# Altium schematic sheet Main.SchDoc
size A3; SheetNumber: 1
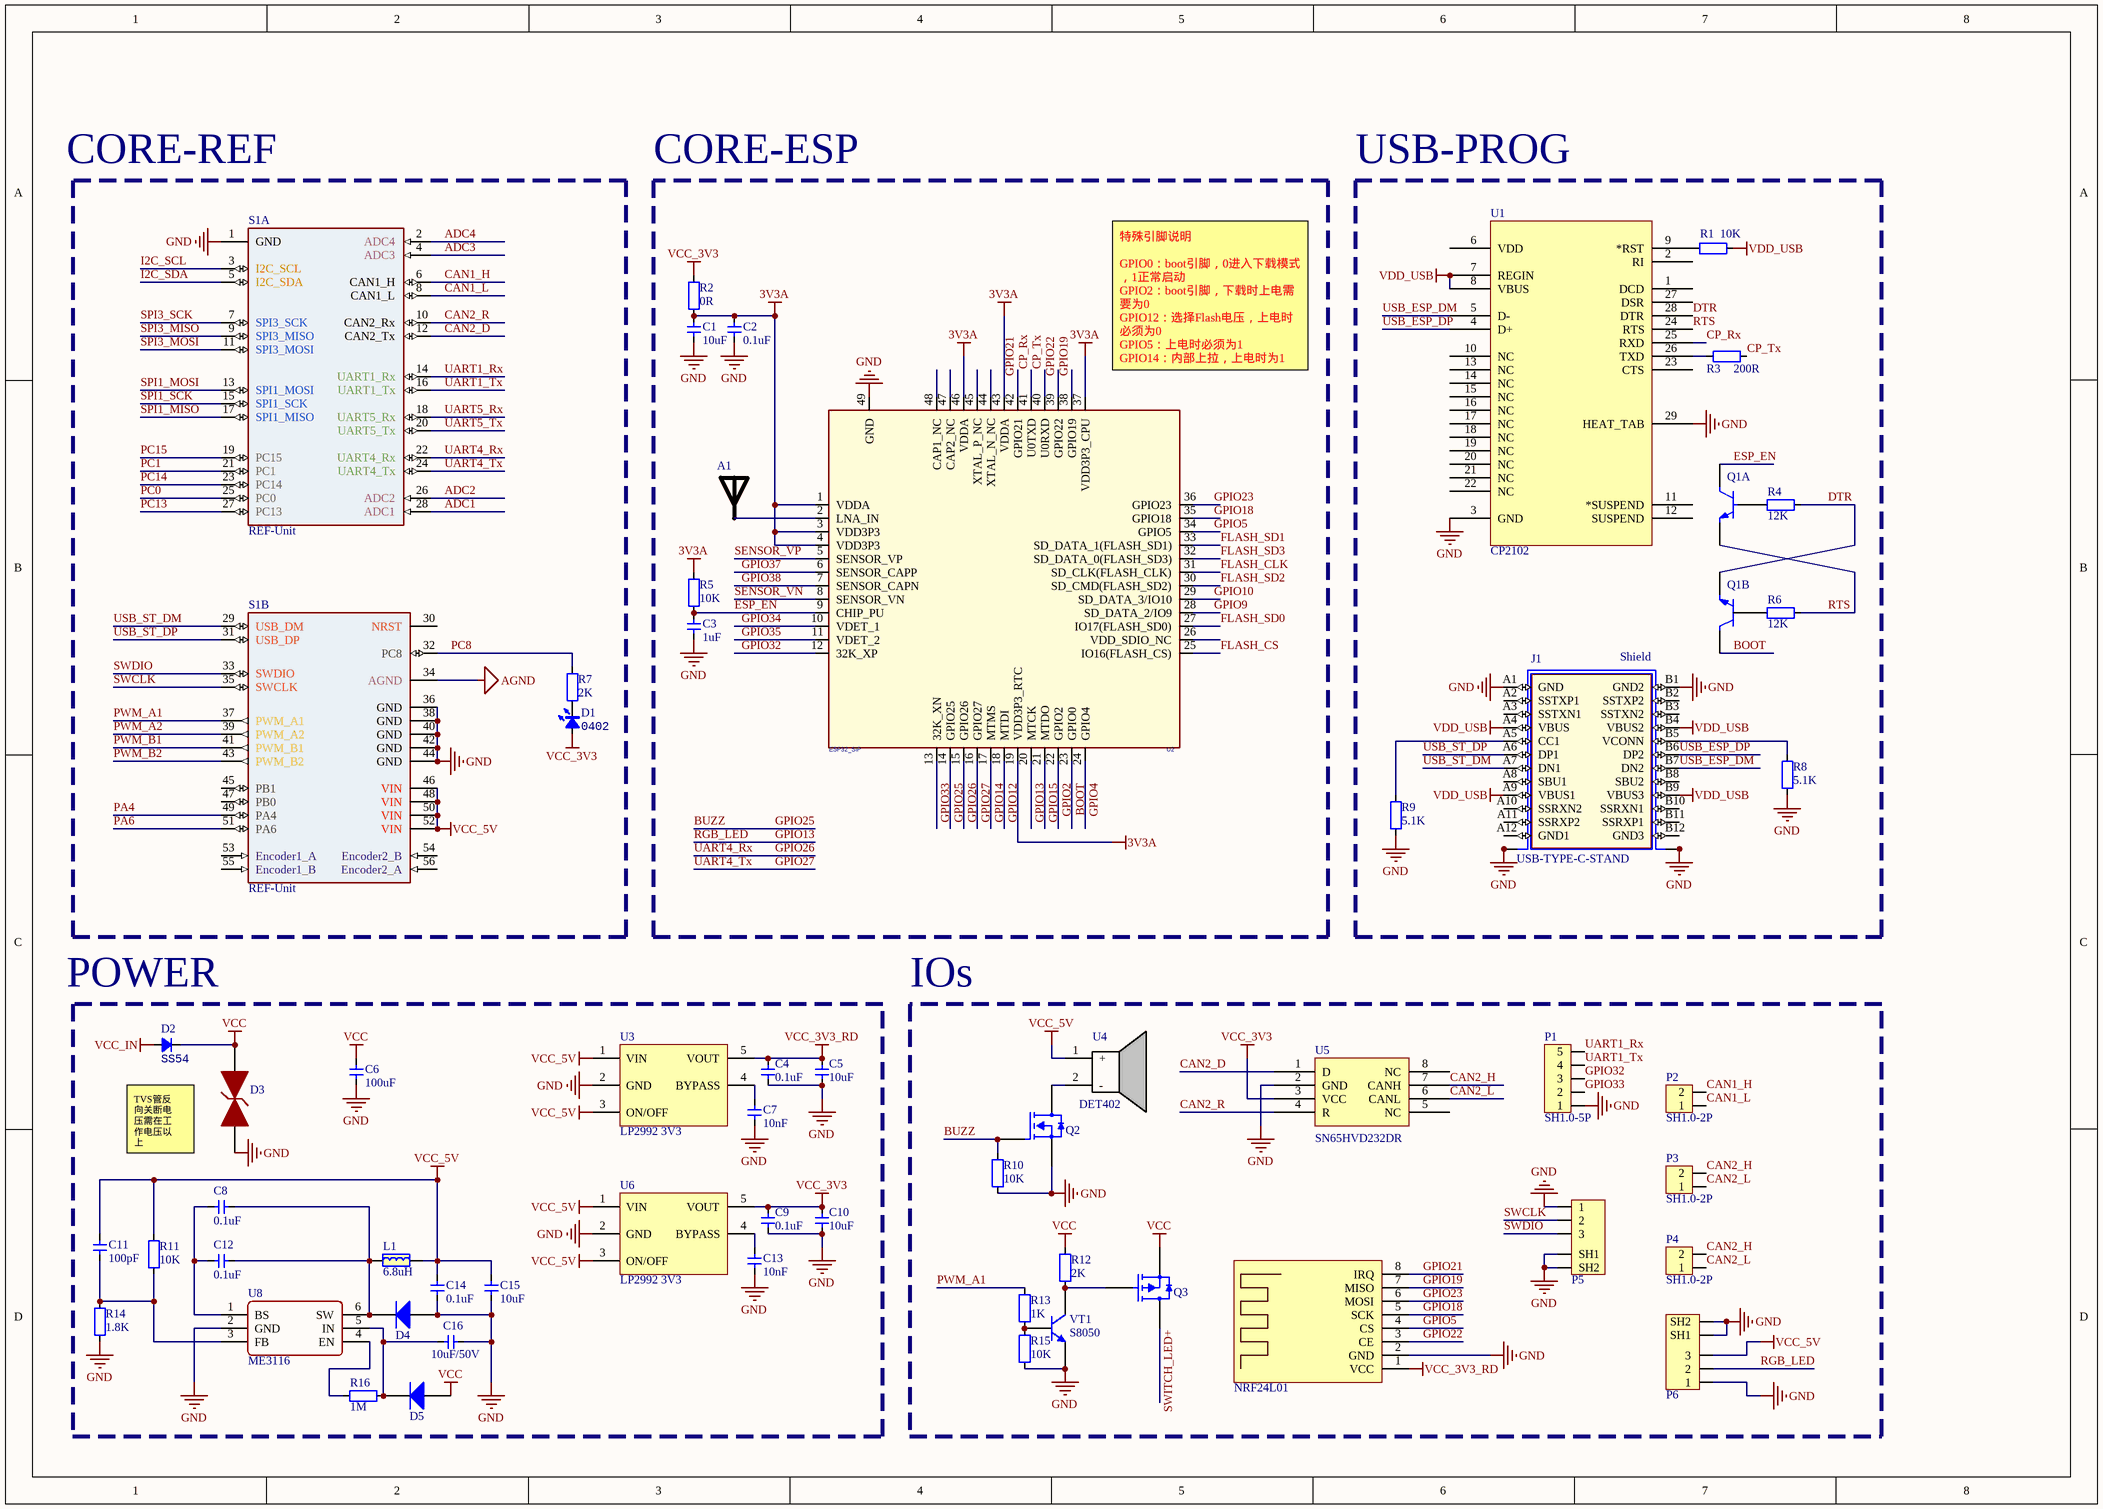
[diagram p0: Main.SchDoc]

## Parts
A1  RAINSUN  [ANT-Rainsun-AN5120]  (value not drawn)
C1  10uF  [CAP_0402]
C2  0.1uF  [CAP_0402]
C3  1uF  [CAP_0402]
C4  0.1uF  [CAP_0402]
C5  10uF  [CAP_0402]
C6  100uF  [1206-CAP]
C7  10nF  [CAP_0402]
C8  0.1uF  [CAP_0402]
C9  0.1uF  [CAP_0402]
C10  10uF  [CAP_0402]
C11  100pF  [CAP_0402]
C12  0.1uF  [CAP_0402]
C13  10nF  [CAP_0402]
C14  0.1uF  [CAP_0402]
C15  10uF  [CAP_0402]
C16  10uF/50V  [CAP_0402]
D1  Type: 0402  [LED_0402_RED]  (hidden comment: color?)
D2  SS54  [DO-214AC]
D3  SMBJ28CA  [SMBJ-CA_MFG]  (value not drawn)
D4  二极管-5819W  [SOD-323]  (value not drawn)
D5  二极管-5819W  [SOD-323]  (value not drawn)
J1  USB-TYPE-C-STAND  [USB-TYPE-C-STAND]
L1  6.8uH  [IND-201612]
P1  SH1.0-5P  [SH1.0-5P]
P2  SH1.0-2P  [SH1.0-2P]
P3  SH1.0-2P  [SH1.0-2P]
P4  SH1.0-2P  [SH1.0-2P]
P5  SH1.0-3P  [SH1.0-3P]  (value not drawn)
P6  SH1.0-3P  [SH1.0-3P]  (value not drawn)
Q1  BC847BVC-7  [SOT563-6]  (value not drawn)  (parts A,B of 2)
Q2  AO3400A  [SOT23-3]  (value not drawn)
Q3  AO3401A  [SOT23-3]  (value not drawn)
R1  10K  [RES_0402]
R2  0R  [RES_0402]
R3  200R  [RES_0402]
R4  12K  [RES_0402]
R5  10K  [RES_0402]
R6  12K  [RES_0402]
R7  2K  [RES_0402]
R8  5.1K  [RES_0402]
R9  5.1K  [RES_0402]
R10  10K  [RES_0402]
R11  10K  [RES_0402]
R12  2K  [RES_0402]
R13  1K  [RES_0402]
R14  1.8K  [RES_0402]
R15  10K  [RES_0402]
R16  1M  [RES_0402]
S1  REF-Unit  [REF-UNIT]  (parts A,B of 2)
U1  CP2102  [QFN-28]
U2  ESP32_SIP  [QFN-48_7X7]
U3  LP2992 3V3  [SOT23-5]
U4  DET402  [DET402]
U5  Manufacturer Part Number: SN65HVD232DR  [SO-8]  (hidden comment: SN65HVD232D)
U6  LP2992 3V3  [SOT23-5]
U7  NRF24L01  [NRF24L01-MODULE]
U8  ME3116  [SOT23-6]
VT1  S8050  [SMT_TRIODE_NPN]

## Blocks framed on the sheet
CORE-ESP: A1 C1-C3 R2 R5 U2
USB-PROG: J1 Q1 R1 R3 R4 R6 R8 R9 U1
IOs: P1-P6 Q2 Q3 R10 R12 R13 R15 U4 U5 U7 VT1

## Nets
3V3A: C1.2 C2.2 R2.2 R5.1 U2.1(VDDA) U2.3(VDD3P3) U2.4(VDD3P3) U2.19(VDD3P3_RTC) U2.37(VDD3P3_CPU) U2.43(VDDA) U2.46(VDDA)
AGND: S1.34(AGND)
GND: C1.1 C2.1 C3.2 C4.1 C5.1 C6.1 C7.1 C9.1 C10.1 C13.1 C14.1 C15.1 C16.1 D3.1 D4.1(A) J1.A1(GND) J1.B1(GND2) J1.S1(SHIELD) J1.S2(SHIELD) J1.S3(SHIELD1) J1.S4(SHIELD1) P1.1 P5.1 P5.SH1 P5.SH2 P6.1 P6.SH1 P6.SH2 Q2.2(S) R8.2 R9.2 R10.1 R14.1 R15.2 S1.1(GND) S1.36(GND) S1.38(GND) S1.40(GND) S1.42(GND) S1.44(GND) U1.3(GND) U1.29(HEAT_TAB) U2.49(GND) U3.2(GND) U5.2(GND) U6.2(GND) U7.2(GND) U8.2(GND) VT1.2(E)
VCC: C6.2 D2.2(K) D3.2 D5.1(A) Q3.2(S) R12.2
VCC_3V3: C9.2 C10.2 D1.1(A) R2.1 U5.3(VCC) U6.5(VOUT)
VCC_3V3_RD: C4.2 C5.2 U3.5(VOUT) U7.1(VCC)
VCC_5V: C11.1 C14.2 C15.2 L1.2 P6.3 R11.2 S1.46(VIN) S1.48(VIN) S1.50(VIN) S1.52(VIN) U3.1(VIN) U3.3(ON/OFF) U4.1(+) U6.1(VIN) U6.3(ON/OFF)
VCC_IN: D2.1(A)
VDD_USB: J1.A4(VBUS) J1.A9(VBUS1) J1.B4(VBUS2) J1.B9(VBUS3) R1.1 U1.7(REGIN) U1.8(VBUS)
ADC1: S1.28(ADC1)
ADC2: S1.26(ADC2)
ADC3: S1.4(ADC3)
ADC4: S1.2(ADC4)
BOOT: Q1.3(C2) U2.23(GPIO0)
BUZZ: Q2.1(G) R10.2 U2.14(GPIO25)  [also labelled GPIO25]
CAN1_H: P2.2 S1.6(CAN1_H)
CAN1_L: P2.1 S1.8(CAN1_L)
CAN2_D: S1.12(CAN2_Tx) U5.1(D)
CAN2_H: P3.2 P4.2 U5.7(CANH)
CAN2_L: P3.1 P4.1 U5.6(CANL)
CAN2_R: S1.10(CAN2_Rx) U5.4(R)
CP_Rx: U1.25(RXD) U2.41(U0TXD)
CP_Tx: R3.1 U2.40(U0RXD)
DTR: Q1.4(E2) R4.1 U1.28(DTR)
ESP_EN: C3.1 Q1.6(C1) R5.2 U2.9(CHIP_PU)
FLASH_CLK: U2.31(SD_CLK(FLASH_CLK))
FLASH_CS: U2.25(IO16(FLASH_CS))
FLASH_SD0: U2.27(IO17(FLASH_SD0))
FLASH_SD1: U2.33(SD_DATA_1(FLASH_SD1))
FLASH_SD2: U2.30(SD_CMD(FLASH_SD2))
FLASH_SD3: U2.32(SD_DATA_0(FLASH_SD3))
GPIO2: U2.22(GPIO2)
GPIO4: U2.24(GPIO4)
GPIO5: U2.34(GPIO5) U7.4(CS)
GPIO9: U2.28(SD_DATA_2/IO9)
GPIO10: U2.29(SD_DATA_3/IO10)
GPIO12: U2.18(MTDI)
GPIO13: P6.2 U2.20(MTCK)  [also labelled RGB_LED]
GPIO14: U2.17(MTMS)
GPIO15: U2.21(MTDO)
GPIO18: U2.35(GPIO18) U7.5(SCK)
GPIO19: U2.38(GPIO19) U7.7(MISO)
GPIO21: U2.42(GPIO21) U7.8(IRQ)
GPIO22: U2.39(GPIO22) U7.3(CE)
GPIO23: U2.36(GPIO23) U7.6(MOSI)
GPIO26: S1.22(UART4_Rx) U2.15(GPIO26)  [also labelled UART4_Rx]
GPIO27: S1.24(UART4_Tx) U2.16(GPIO27)  [also labelled UART4_Tx]
GPIO32: P1.3 U2.12(32K_XP)
GPIO33: P1.2 U2.13(32K_XN)
GPIO34: U2.10(VDET_1)
GPIO35: U2.11(VDET_2)
GPIO37: U2.6(SENSOR_CAPP)
GPIO38: U2.7(SENSOR_CAPN)
I2C_SCL: S1.3(I2C_SCL)
I2C_SDA: S1.5(I2C_SDA)
PA4: S1.49(PA4)
PA6: S1.51(PA6)
PC0: S1.25(PC0)
PC1: S1.21(PC1)
PC8: R7.1 S1.32(PC8)
PC13: S1.27(PC13)
PC14: S1.23(PC14)
PC15: S1.19(PC15)
PWM_A1: R13.1 S1.37(PWM_A1)
PWM_A2: S1.39(PWM_A2)
PWM_B1: S1.41(PWM_B1)
PWM_B2: S1.43(PWM_B2)
RTS: Q1.1(E1) R6.1 U1.24(RTS)
SENSOR_VN: U2.8(SENSOR_VN)
SENSOR_VP: U2.5(SENSOR_VP)
SPI1_MISO: S1.17(SPI1_MISO)
SPI1_MOSI: S1.13(SPI1_MOSI)
SPI1_SCK: S1.15(SPI1_SCK)
SPI3_MISO: S1.9(SPI3_MISO)
SPI3_MOSI: S1.11(SPI3_MOSI)
SPI3_SCK: S1.7(SPI3_SCK)
SWCLK: P5.2 S1.35(SWCLK)
SWDIO: P5.3 S1.33(SWDIO)
SWITCH_LED+: Q3.3(D)
UART1_Rx: P1.5 S1.14(UART1_Rx)
UART1_Tx: P1.4 S1.16(UART1_Tx)
UART5_Rx: S1.18(UART5_Rx)
UART5_Tx: S1.20(UART5_Tx)
USB_ESP_DM: J1.B7(DN2) U1.5(D-)
USB_ESP_DP: J1.B6(DP2) U1.4(D+)
USB_ST_DM: J1.A7(DN1) S1.29(USB_DM)
USB_ST_DP: J1.A6(DP1) S1.31(USB_DP)
NetA1_1: A1.1 U2.2(LNA_IN)
NetC7_2: C7.2 U3.4(BYPASS)
NetC8_1: C8.1 C12.1 D4.2(K) L1.1 U8.6(SW)
NetC8_2: C8.2 C12.2 U8.1(BS)
NetC11_2: C11.2 R11.1 R14.2 U8.3(FB)
NetC13_2: C13.2 U6.4(BYPASS)
NetC16_2: C16.2 D5.2(K) R16.1 U8.5(IN)
NetD1_2: D1.2(K) R7.2
NetJ1_A5: J1.A5(CC1) R9.1
NetJ1_B5: J1.B5(VCONN) R8.1
NetQ1_2: Q1.2(B1) R4.2
NetQ1_5: Q1.5(B2) R6.2
NetQ2_3: Q2.3(D) U4.2(-)
NetQ3_1: Q3.1(G) R12.1 VT1.3(C)
NetR1_2: R1.2 U1.9(*RST)
NetR3_2: R3.2 U1.26(TXD)
NetR13_2: R13.2 R15.1 VT1.1(B)
NetR16_2: R16.2 U8.4(EN)

Not connected (* = marked no-connect by the designer): J1 A2(SSTXP1) A3(SSTXN1) A8(SBU1) A10(SSRXN2) A11(SSRXP2) A12(GND1) B2(SSTXP2) B3(SSTXN2) B8(SBU2) B10(SSRXN1) B11(SSRXP1) B12(GND3); S1 30(NRST) 45(PB1) 47(PB0) 53(Encoder1_A) 54(Encoder2_B) 55(Encoder1_B) 56(Encoder2_A); U1 1(DCD) 2(RI) 6(VDD) 10(NC) 11(*SUSPEND) 12(SUSPEND) 13(NC) 14(NC) 15(NC) 16(NC) 17(NC) 18(NC) 19(NC) 20(NC) 21(NC) 22(NC) 23(CTS) 27(DSR); U2 26(VDD_SDIO_NC) 44(XTAL_N_NC) 45(XTAL_P_NC) 47(CAP2_NC) 48(CAP1_NC); U5 5(NC) 8(NC)

## Notes on the sheet
- CORE-REF
- (near U2) 特殊引脚说明
  GPIO0：boot引脚，0进入下载模式，1正常启动
  GPIO2：boot引脚，下载时上电需要为0
  GPIO12：选择Flash电压，上电时必须为0
  GPIO5：上电时必须为1
  GPIO14：内部上拉，上电时为1
  GPIO15：上电时必须为1
- (near D2) POWER
- TVS管反
  向关断电
  压需在工
  作电压以
  上
- (in symbol USB-TYPE-C-STAND) Shield

## Library data of the parts
A1 = ANT-Rainsun-AP5120
C1-C5 C7-C16 = 电容-0402: Capacitor; Value: 0.1u
C6 = 电容-1206: Capacitor; Value: 0.1u
D1 = LED_0402: LED; Value: color?
D2 = Diode_SMA: Diode; Type: SMA; Value: SS54
D4 D5 = 二极管-5819W: 40V
J1 = USB-TYPE-C-STAND: MP: 632722110112; MF: Wurth Electronics; SnapEDA_Link: https://www.snapeda.com/parts/632722110112/Wurth%20Electronics%20Inc./view-part/3596593/?ref=snap; Price: None; DigiKey-Purchase-URL: https://snapeda.com/shop?store=DigiKey&id=3596593; Package: None; Availability: Unavailable; Value: *
L1 = 电感-201612
P5 P6 = SH1.0-3P: Header
Q2 = AO3400A: N-MOS
Q3 = AO3401A: P-MOS
R1-R16 = 电阻-0402: Resistor; Value: 22R
S1 = REF-Unit: Robot Embedded Framework based on STM43F405RGT6.
U1 = CP2102: USB转TTL; PART DESC: SINGLE-CHIP USB TO UART BRIDGE, QFN28, RoHS.; MFG #1: SILICON LABS; PART NUMBER: CP2102; Value: Value; RefDes: RefDes; Type: DEV
U2 = ESP32-PICO
U3 U6 = LP2992: LDO
U5 = SN65HVD232D: Manufacturer: Texas Instruments; Protocol: CAN; Number of Drivers/Receivers: 1/1; Duplex: Half; Data Rate: 1Mbps; Voltage - Supply: 3 V ~ 3.6 V; Supplier 1: Digi-Key; Supplier Part Number 1: 296-26344-2-ND; RoHS: RoHS Compliant; Category: Integrated Circuits (ICs); Stock: 5000; Pricing 1: 2500=0.84375 (USD); Packaging: Tape & Reel (TR); Part Status: Active; Type: Transceiver; Operating Temperature: -40°C ~ 85°C; Mounting Type: Surface Mount; Package / Case: 8-SOIC (0.154", 3.90mm Width); Supplier Device Package: 8-SOIC; ComponentLink1URL: http://www.ti.com/lit/ds/symlink/sn65hvd230.pdf; ComponentLink1Description: http://www.ti.com/lit/ds/symlink/sn65hvd230.pdf; Supplier 2: Digi-Key; Supplier Part Number 2: 296-26344-1-ND; Pricing 2: 1=2.05, 10=1.842, 100=1.4809, 500=1.21668, 1000=1.00811 (USD)
U7 = NRF24L01模块
U8 = ME3116: DC-DC
VT1 = SMT_TRIODE_NPN: Surface mount NPN transistor, package SOT-23